# Altium schematic sheet Interfaz_RTC.SchDoc
size Letter; ApprovedBy: M. en C. Fernando Bolaños; CheckedBy: M. en C. José Alberto Balderas Castillo (CID); Author: M. en C. José Alberto Balderas Castillo (CID); Revision: v1; NombreTarjeta: TELCOMGPRS-v1; NumeroDeHoja: 4 de 7; NombreBloque: Reloj de Tiempo Real; FechaDiseno: 02-Junio-2015; FechaRevision: 05-Junio-2015; FechaAprobacion: 16-Junio-2015; TamanoHoja: Carta; NombreProyecto: Telemetria GPRS de Bajo Consumo de Energia
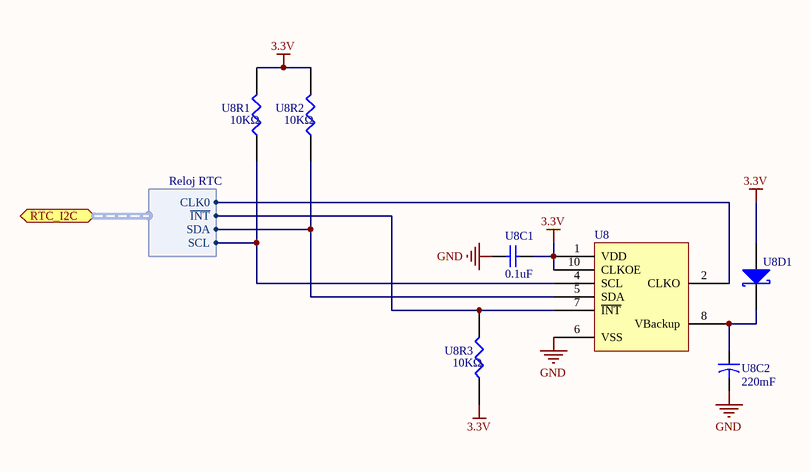
[diagram p0: Interfaz_RTC.SchDoc]

## Parts
U8  (no value)  [RV-3029-C2]
U8C1  0.1uF  [0603 - CAP]
U8C2  220mF  [DSK-3R3H224U-HL]
U8D1  NSR0320MW2T1G  [SOD-323]  (value not drawn)
U8R1  10KΩ  [0805-RES]
U8R2  10KΩ  [0805-RES]
U8R3  10KΩ  [0805-RES]

## Ports
RTC_I2C (harness Reloj RTC)

## Harnesses
Reloj RTC: CLK0, ~{INT}, SDA, SCL

## Nets
3.3V: U8.1(VDD) U8.10(CLKOE) U8C1.1 U8D1.1(A) U8R1.2 U8R2.2 U8R3.1
GND: U8.6(VSS) U8C1.2 U8C2.2
NetU8_2: U8.2(CLKO) ; port RTC_I2C.CLK0
NetU8_4: U8.4(SCL) U8R1.1 ; port RTC_I2C.SCL
NetU8_5: U8.5(SDA) U8R2.1 ; port RTC_I2C.SDA
NetU8_7: U8.7(~{INT}) U8R3.2 ; port RTC_I2C.~{INT}
NetU8_8: U8.8(VBackup) U8C2.1 U8D1.2(K)

Not connected (* = marked no-connect by the designer): U8 3(NC) 9(NC)

## Notes on the sheet
- Elaboró
- Fecha
- Nombre del artículo
- Revisó
- Aprobó
- Número de parte
- Revisión
- Escala
- N/A
- Sección afectada
- Descripción del cambio
- Lámina
- 1/1
- Tolerancias
- Ruta del archivo

## Library data of the parts
U8 = RV-3029-C2 B: MICRO CRYSTAL - RV-3029-C2 OPTION B - REAL-TIME-CLOCK, SMD, I2C, 32.768KHZ; Manufacturer: Micro Crystal Switzerland; Manufacturer Part Number: RV-3029-C2; Supplier 1: Newark; Supplier Part Number 1: 19P2786; Supplier 2: Mouser; Supplier Part Number 2: 428-202115-MG01
U8C1 = Cap: CAP CERAMIC 0.1UF, 25V, X7R, 0603; Manufacturer Part Number: CGJ3E2X7R1E104K080AA; Manufacturer: TDK Corporation; Value: 0.1uF; Supplier 1: Digi-Key; Supplier Part Number 1: 445-8129-1-ND
U8C2 = Cap2: CAP 220MF -20% +80% 3.3V SMD; Manufacturer: Elna America; Value: 220mF; Supplier 1: Digi-Key; Supplier Part Number 1: 604-1020-1-ND; Manufacturer Part Number: DSK-3R3H224U-HL; Voltage - Rated: 3.3V
U8D1 = 10MQ060N: DIODE SCHOTTKY 1A 20V SOD-323; Manufacturer: On Semiconductor; Manufacturer Part Number: NSR0320MW2T1G; Supplier 1: Digi-Key; Supplier Part Number 1: NSR0320MW2T1GOSCT-ND
U8R1-U8R3 = RES1: 10 kOhms ±5% 0.125W, 1/8W Chip Resistor 0805; Manufacturer Part Number: RC0805JR-0710KL; Manufacturer: Yageo; Value: 10KΩ; Supplier 1: Digi-Key; Supplier Part Number 1: 311-10KARCT-ND